# Altium schematic sheet Sheet1.SchDoc
size A4; SheetNumber: 1; SheetTotal: 3
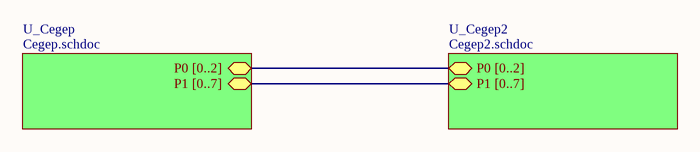
[diagram p0: Sheet1.SchDoc]

## Sub-sheets
U_Cegep = Cegep.schdoc: P0 [0..2] (bidir), P1 [0..7] (bidir)
U_Cegep2 = Cegep2.schdoc: P0 [0..2] (bidir), P1 [0..7] (bidir)

## Nets
(unnamed): sheet U_Cegep/P0 [0..2], sheet U_Cegep2/P0 [0..2]
(unnamed): sheet U_Cegep/P1 [0..7], sheet U_Cegep2/P1 [0..7]